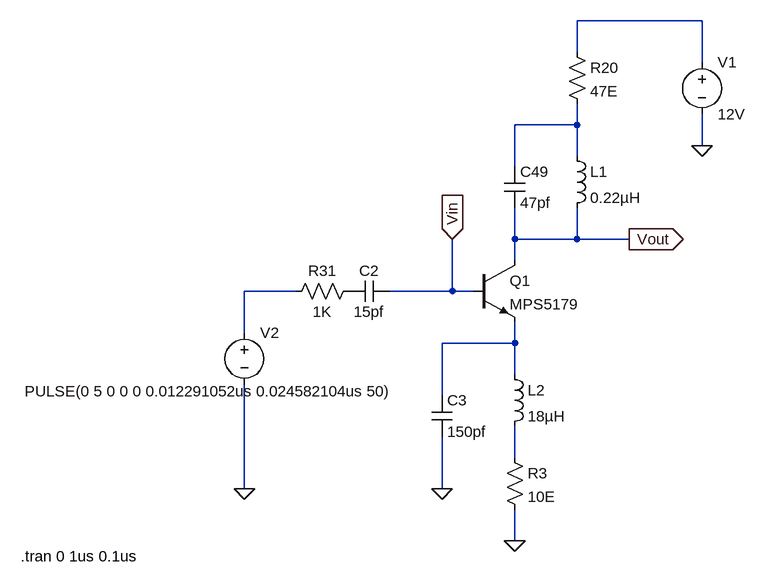
[diagram p0: schematic With_Q1_MPS5179_only.asc]
With_Q1_MPS5179_only.asc, the LTspice schematic file:
Version 4
SHEET 1 1496 680
WIRE 496 -272 304 -272
WIRE 304 -224 304 -272
WIRE 496 -208 496 -272
WIRE 304 -112 304 -144
WIRE 304 -112 208 -112
WIRE 496 -80 496 -128
WIRE 304 -64 304 -112
WIRE 208 -48 208 -112
WIRE 208 64 208 16
WIRE 304 64 304 16
WIRE 304 64 208 64
WIRE 384 64 304 64
WIRE 208 96 208 64
WIRE -128 144 -208 144
WIRE 112 144 112 64
WIRE 112 144 16 144
WIRE 144 144 112 144
WIRE -208 208 -208 144
WIRE 208 224 208 192
WIRE 208 224 96 224
WIRE 208 272 208 224
WIRE 96 304 96 224
WIRE 208 400 208 352
WIRE -208 448 -208 288
WIRE 96 448 96 368
WIRE 208 528 208 480
FLAG 496 -80 0
FLAG 96 448 0
FLAG 208 528 0
FLAG -208 448 0
FLAG 112 64 Vin
IOPIN 112 64 In
FLAG 384 64 Vout
IOPIN 384 64 Out
SYMBOL cap 192 -48 R0
SYMATTR InstName C49
SYMATTR Value 47pf
SYMBOL ind 288 -80 R0
SYMATTR InstName L1
SYMATTR Value 0.22µH
SYMBOL cap 80 304 R0
SYMATTR InstName C3
SYMATTR Value 150pf
SYMBOL ind 192 256 R0
SYMATTR InstName L2
SYMATTR Value 18µH
SYMBOL res 192 384 R0
SYMATTR InstName R3
SYMATTR Value 10E
SYMBOL res 288 -240 R0
SYMATTR InstName R20
SYMATTR Value 47E
SYMBOL voltage 496 -224 R0
SYMATTR InstName V1
SYMATTR Value 12V
SYMBOL cap 16 128 R90
WINDOW 0 0 32 VBottom 2
WINDOW 3 32 32 VTop 2
SYMATTR InstName C2
SYMATTR Value 15pf
SYMBOL res -32 128 R90
WINDOW 0 0 56 VBottom 2
WINDOW 3 32 56 VTop 2
SYMATTR InstName R31
SYMATTR Value 1K
SYMBOL voltage -208 192 R0
WINDOW 3 -338 106 Left 2
SYMATTR Value PULSE(0 5 0 0 0 0.012291052us 0.024582104us 50)
SYMATTR InstName V2
SYMBOL npn 144 96 R0
SYMATTR InstName Q1
SYMATTR Value MPS5179
TEXT -552 552 Left 2 !.tran 0 1us 0.1us

The netlist it stands for:
* With_Q1_MPS5179_only.asc
C49 N002 Vout 47pf
L1 N002 Vout 0.22µH
C3 N004 0 150pf
L2 N004 N005 18µH
R3 N005 0 10E
R20 N001 N002 47E
V1 N001 0 12V
C2 Vin P001 15pf
R31 P001 N003 1K
V2 N003 0 PULSE(0 5 0 0 0 0.012291052us 0.024582104us 50)
Q1 Vout Vin N004 0 MPS5179
.model NPN NPN
.model PNP PNP
.lib standard.bjt
.tran 0 1us 0.1us
.backanno
.end

* Results of the author's LTspice run, read from the files saved beside the schematic
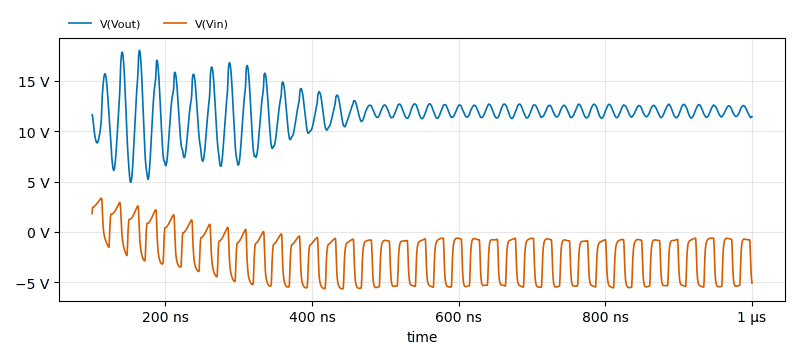
[diagram p1: Transient Analysis of With_Q1_MPS5179_only.asc, plotted from the saved traces]
* Transient Analysis, 1 run:
*   V(Vout): min 4.929 V, max 18.05 V, average 11.74 V, rms 11.89 V, last 11.45 V
*   V(Vin): min -5.667 V, max 3.343 V, average -2.261 V, rms 3.244 V, last -5.099 V